# EAGLE design 2 byte input (EAGLE 9.5.0)
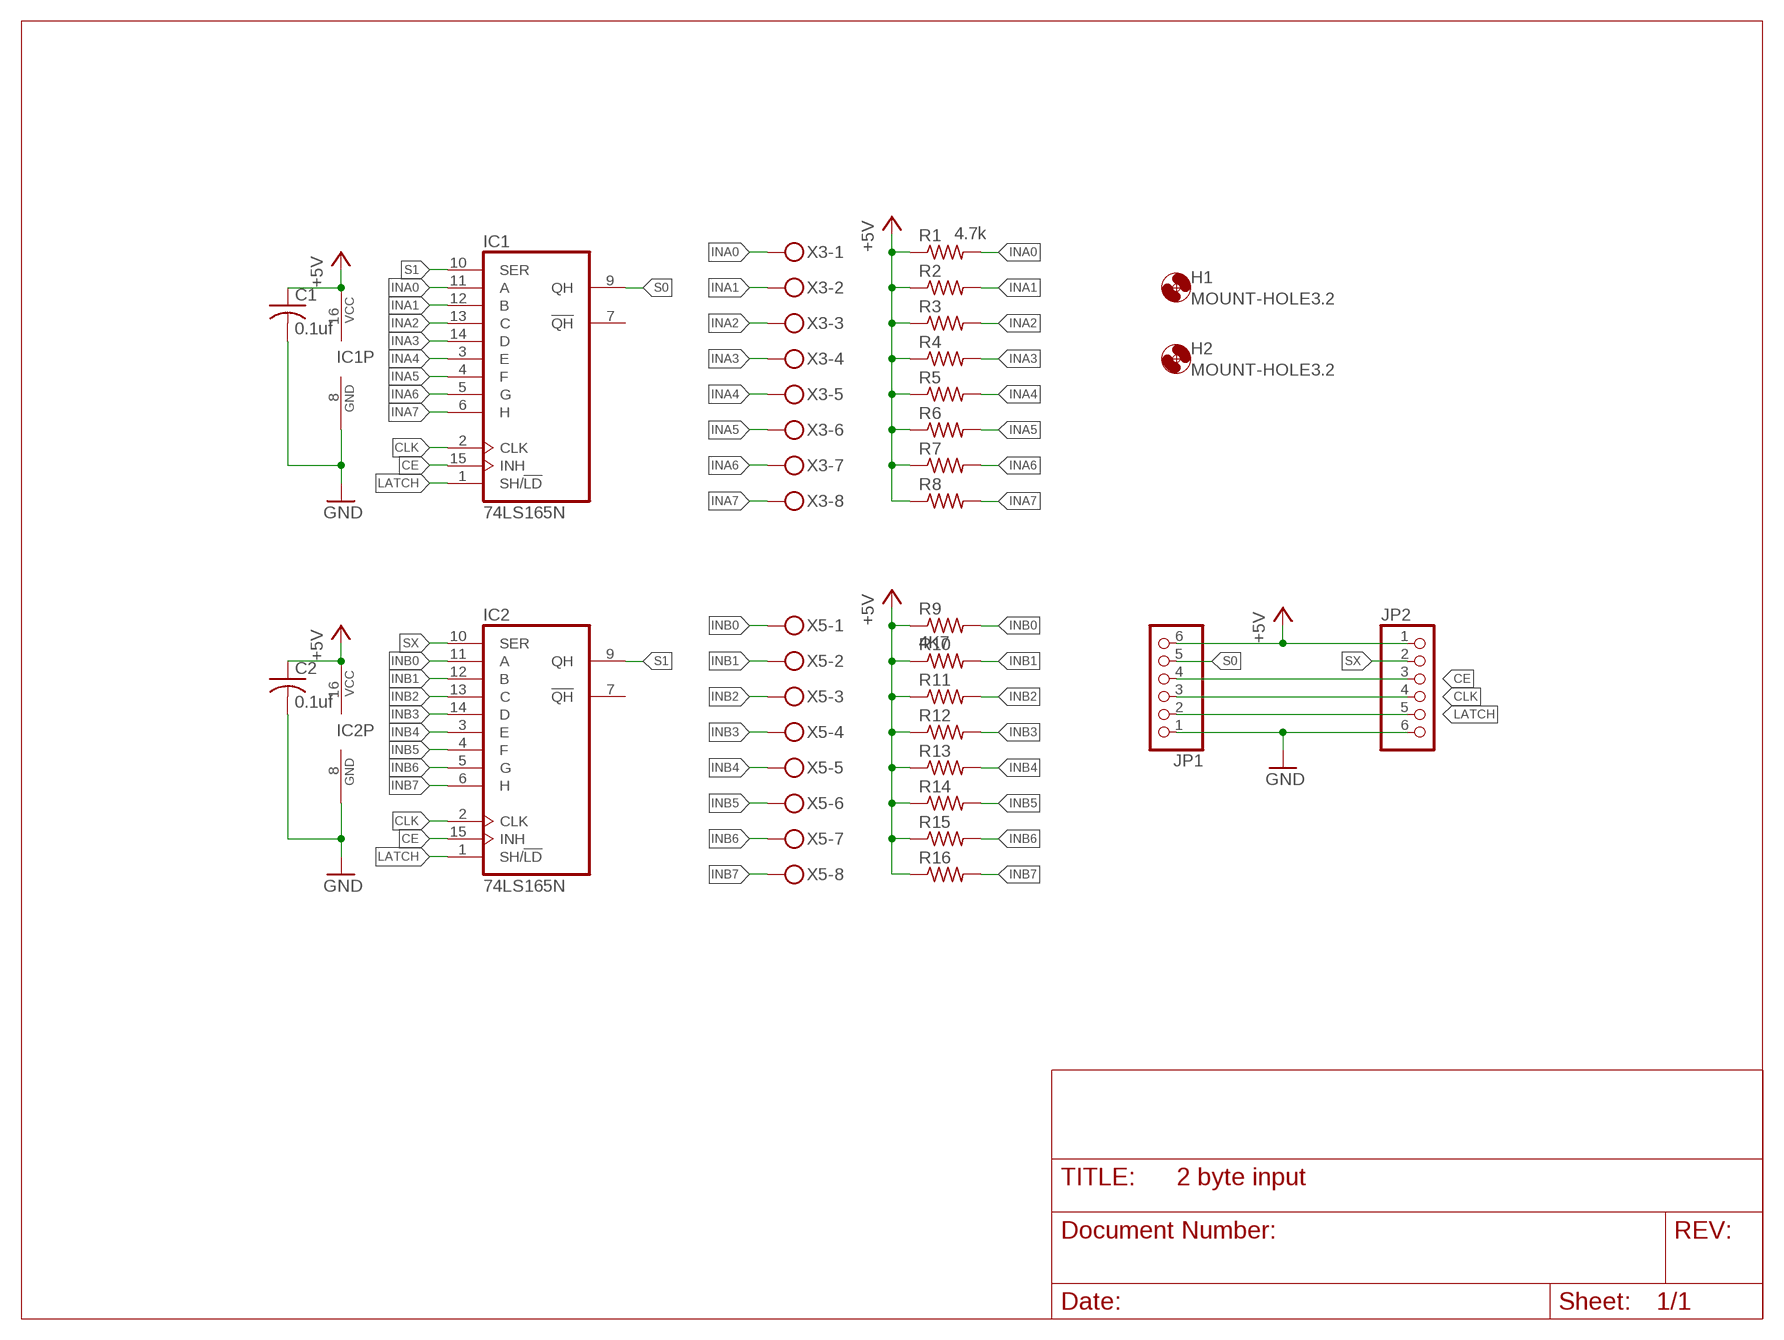
[diagram p0: schematic, sheet 1]

## Parts
C1  0.1uf  C-US025-025X050  [C025-025X050]
C2  0.1uf  C-US025-025X050  [C025-025X050]
H1  MOUNT-HOLE3.2  [3,2]
H2  MOUNT-HOLE3.2  [3,2]
IC1  74LS165N  [DIL16]
IC2  74LS165N  [DIL16]
JP1  PINHD-1X6/90  [1X06/90]
JP2  PINHD-1X6/90  [1X06/90]
R1  4.7k  R-US_0207/2V  [0207/2V]
R2  R-US_0207/2V  [0207/2V]
R3  R-US_0207/2V  [0207/2V]
R4  R-US_0207/2V  [0207/2V]
R5  R-US_0207/2V  [0207/2V]
R6  R-US_0207/2V  [0207/2V]
R7  R-US_0207/2V  [0207/2V]
R8  R-US_0207/2V  [0207/2V]
R9  4K7  R-US_0207/2V  [0207/2V]
R10  R-US_0207/2V  [0207/2V]
R11  R-US_0207/2V  [0207/2V]
R12  R-US_0207/2V  [0207/2V]
R13  R-US_0207/2V  [0207/2V]
R14  R-US_0207/2V  [0207/2V]
R15  R-US_0207/2V  [0207/2V]
R16  R-US_0207/2V  [0207/2V]
X3  MKDSN1,5/8-5,08  [MKDSN1,5/8-5,08]
X5  MKDSN1,5/8-5,08  [MKDSN1,5/8-5,08]

## Nets
+5V: C1.1 C2.1 IC1.16(VCC) IC2.16(VCC) JP1.6 JP2.1 R1.1 R2.1 R3.1 R4.1 R5.1 R6.1 R7.1 R8.1 R9.1 R10.1 R11.1 R12.1 R13.1 R14.1 R15.1 R16.1
CE: IC1.15(INH) IC2.15(INH) JP1.4 JP2.3
CLK: IC1.2(CLK) IC2.2(CLK) JP1.3 JP2.4
GND: C1.2 C2.2 IC1.8(GND) IC2.8(GND) JP1.1 JP2.6
INA0: IC1.11(A) R1.2 X3.1
INA1: IC1.12(B) R2.2 X3.2
INA2: IC1.13(C) R3.2 X3.3
INA3: IC1.14(D) R4.2 X3.4
INA4: IC1.3(E) R5.2 X3.5
INA5: IC1.4(F) R6.2 X3.6
INA6: IC1.5(G) R7.2 X3.7
INA7: IC1.6(H) R8.2 X3.8
INB0: IC2.11(A) R9.2 X5.1
INB1: IC2.12(B) R10.2 X5.2
INB2: IC2.13(C) R11.2 X5.3
INB3: IC2.14(D) R12.2 X5.4
INB4: IC2.3(E) R13.2 X5.5
INB5: IC2.4(F) R14.2 X5.6
INB6: IC2.5(G) R15.2 X5.7
INB7: IC2.6(H) R16.2 X5.8
LATCH: IC1.1(SH/!LD) IC2.1(SH/!LD) JP1.2 JP2.5
S0: IC1.9(QH) JP1.5
S1: IC1.10(SER) IC2.9(QH)
SX: IC2.10(SER) JP2.2
Unconnected: IC1.7(!QH) IC2.7(!QH)

## Library data of the parts
C1 C2 = resistor:C-US: CAPACITOR, American symbol
H1 H2 = holes:MOUNT-HOLE: MOUNTING HOLE with drill center marker
IC1 IC2 = 74xx-us:74*165: 8-bit parallel load SHIFT REGISTER
JP1 JP2 = pinhead:PINHD-1X6: PIN HEADER
R1-R16 = resistor:R-US_: RESISTOR, American symbol
X3 X5 = con-phoenix-508:MKDSN1,5/8-5,08: MKDSN 1,5/ 8-5,08 Printklemme Nennstrom: 13,5 A Nennspannung: 250 V Rastermaß: 5,08 mm Polzahl: 8 Anschlussart: Schraubanschluss Montage: Löten Anschlussrichtung Leiter/Platine: 0 ° Artikelnummer: 1729186 Source: http://eshop.phoenixcontact.com .. 1729186.pdf

## Board
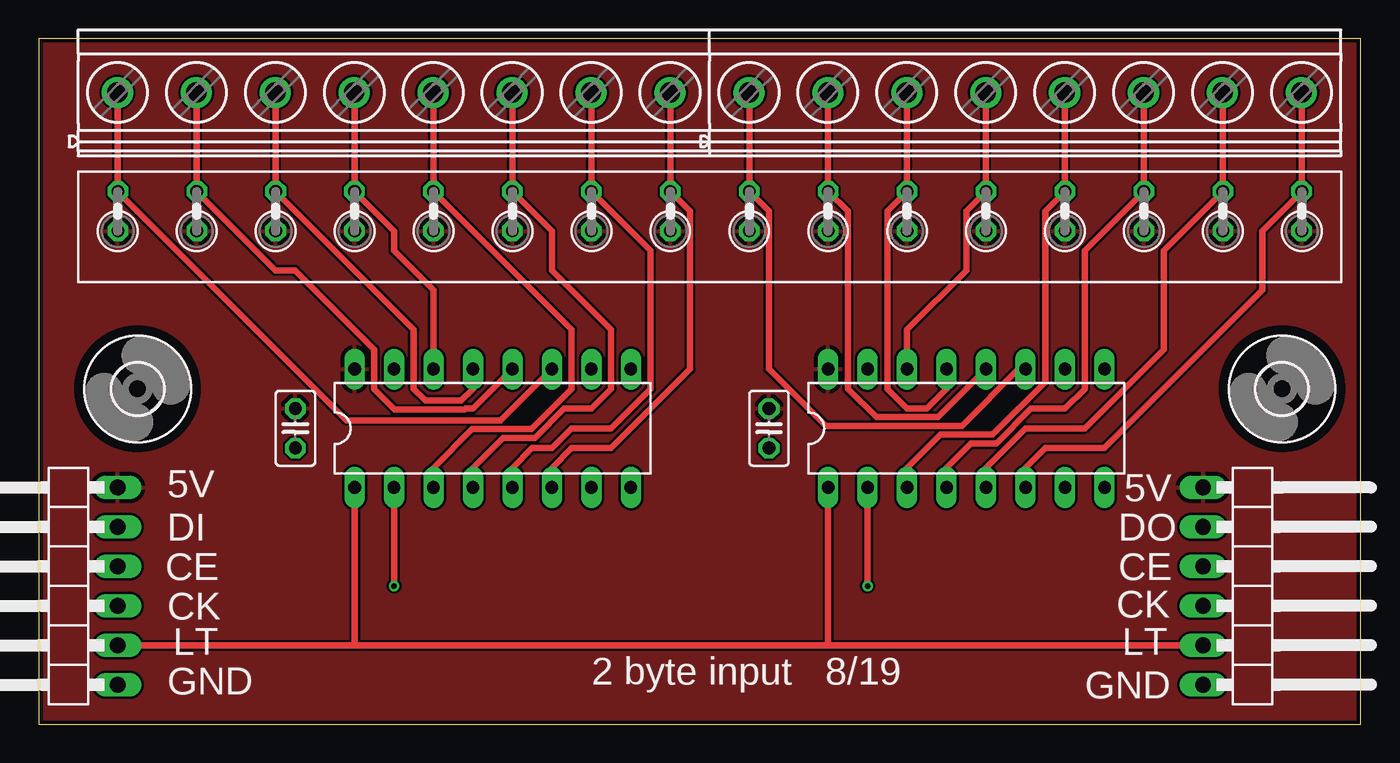
[diagram p1: board, top side]
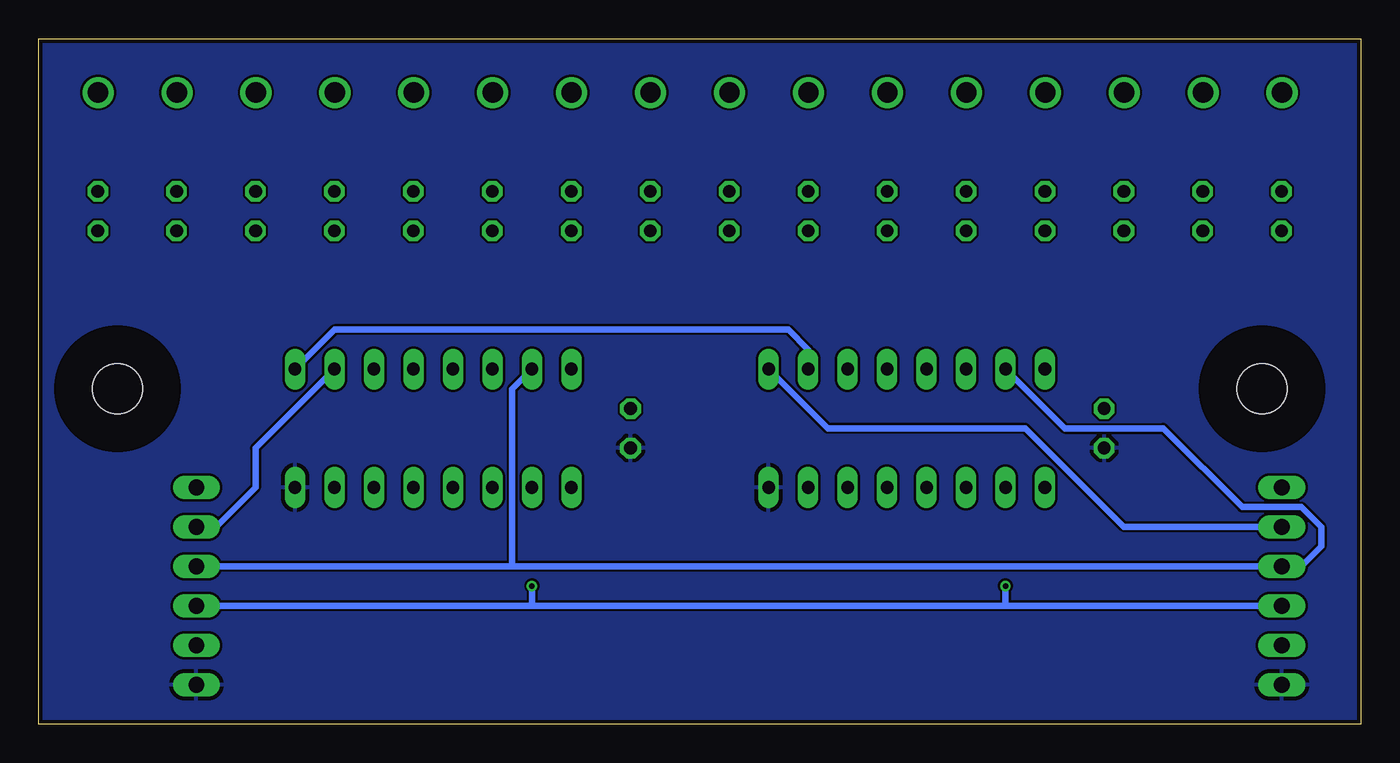
[diagram p2: board, bottom side, seen from below]

Size 85.07 x 44.12 mm. Coordinates in mm from the lower left corner, seen from the top.
Outline: 0,0 85.07,0 85.07,44.12 0,44.12 0,0
Copper layers (1*16): Top 0.035mm / dielectric 1.5mm / Bottom 0.035mm
Design rules "SeeedStudio_2layer": minimum track width 6mil, minimum drill 12mil, track to track 6mil, track to pad 6mil, pad to pad 6mil, via to via 6mil, smd to smd 0mil, copper to edge 10mil, drill to drill 10mil, minimum pad ring 10mil, minimum via ring 6mil, stop-mask expansion 2mil, vias tented up to drill 100mil, thermal gap 10mil

### Footprints (pad centres in the part's own frame; a part is rotated, then mirrored left to right if it is on the bottom)
C025-025X050 = drill 0.813 octagon: 1 -1.27,0; 2 1.27,0
3,2 = hole 3.2: 0,0
DIL16 = drill 0.813 long: 1 -8.89,-3.81; 2 -6.35,-3.81; 3 -3.81,-3.81; 4 -1.27,-3.81; 5 1.27,-3.81; 6 3.81,-3.81; 7 6.35,-3.81; 8 8.89,-3.81; 9 8.89,3.81; 10 6.35,3.81; 11 3.81,3.81; 12 1.27,3.81; 13 -1.27,3.81; 14 -3.81,3.81; 15 -6.35,3.81; 16 -8.89,3.81
1X06/90 = drill 1.016 long: 1 -6.35,-3.81; 2 -3.81,-3.81; 3 -1.27,-3.81; 4 1.27,-3.81; 5 3.81,-3.81; 6 6.35,-3.81
0207/2V = drill 0.813 octagon: 1 -1.27,0; 2 1.27,0
MKDSN1,5/8-5,08 = drill 1.3 pad 2: 1 -17.801,0.025; 2 -12.721,0.025; 3 -7.641,0.025; 4 -2.561,0.025; 5 2.519,0.025; 6 7.599,0.025; 7 12.679,0.025; 8 17.759,0.025

### Placement (x,y rotation side)
C1  16.51,19.05 270 top
C2  46.99,19.05 270 top
H1  6.35,21.59 0 top
H2  80.01,21.59 0 top
IC1  29.21,19.05 0 top
IC2  59.69,19.05 0 top
JP1  1.27,8.89 90 top
JP2  78.74,8.89 270 top
R1  5.08,33.02 90 top
R2  10.16,33.02 90 top
R3  15.24,33.02 90 top
R4  20.32,33.02 90 top
R5  25.4,33.02 90 top
R6  30.48,33.02 90 top
R7  35.56,33.02 90 top
R8  40.64,33.02 90 top
R9  45.72,33.02 90 top
R10  50.8,33.02 90 top
R11  55.88,33.02 90 top
R12  60.96,33.02 90 top
R13  66.04,33.02 90 top
R14  71.12,33.02 90 top
R15  76.2,33.02 90 top
R16  81.28,33.02 90 top
X3  22.86,40.64 0 top
X5  63.5,40.64 0 top

### Tracks (layer width: path | path; a pad name or v marks a point on that pad's centre or on a via)
+5V
  pour Top: -2.54,49.53 87.63,49.53 87.63,-1.27 -1.27,-1.27 -2.54,0
CE
  Bottom 0.406: 54.61,10.16 JP1.4 3.81,10.16 2.54,11.43 2.54,12.7 3.81,13.97 7.62,13.97 12.7,19.05 19.05,19.05 IC1.15 | 54.61,10.16 JP2.3 | IC2.15 54.61,21.59 54.61,10.16
CLK  (via drill 0.35)
  Top 0.406: IC1.2 v22.86,8.89 | IC2.2 v53.34,8.89
  Bottom 0.406: JP1.3 22.86,7.62 | 22.86,7.62 53.34,7.62 | 53.34,7.62 JP2.4 | v22.86,8.89 22.86,7.62 | v53.34,8.89 53.34,7.62
GND
  pour Bottom: -2.54,52.07 87.63,52.07 87.63,-1.27 -2.54,-1.27
INA0
  Top 0.406: X3.1 5.08,40.64 R1.2 19.81,19.56 29.72,19.56 IC1.11
INA1
  Top 0.406: X3.2 10.16,40.64 R2.2 15.24,29.21 16.51,29.21 21.59,24.13 21.59,21.59 22.91,20.27 27.41,20.27 27.46,20.32 27.94,20.32 IC1.12
INA2
  Top 0.406: X3.3 15.24,40.64 R3.2 24.13,25.4 24.13,21.59 24.89,20.83 27.18,20.83 27.94,21.59 IC1.13
INA3
  Top 0.406: X3.4 20.32,40.64 R4.2 22.86,31.75 22.86,30.48 25.4,27.94 IC1.14
INA4
  Top 0.406: X3.5 25.4,40.64 R5.2 34.29,25.4 34.29,21.59 31.7,19 27.89,19 25.4,16.51 IC1.3
INA5
  Top 0.406: X3.6 30.48,40.64 R6.2 33.02,31.75 33.02,29.21 36.83,25.4 36.83,21.59 35.56,20.32 33.81,20.32 31.93,18.44 29.87,18.44 27.94,16.51 IC1.4
INA6
  Top 0.406: X3.7 35.56,40.64 R7.2 39.37,30.48 39.37,21.59 36.83,19.05 34.29,19.05 33.02,17.78 31.75,17.78 30.48,16.51 IC1.5
INA7
  Top 0.406: X3.8 40.64,40.64 R8.2 41.91,33.02 41.91,22.86 36.83,17.78 34.29,17.78 33.02,16.51 IC1.6
INB0
  Top 0.406: X5.1 45.72,40.64 R9.2 46.99,33.02 46.99,22.86 50.65,19.2 59.4,19.2 63.06,22.86 IC2.11
INB1
  Top 0.406: X5.2 50.8,40.64 R10.2 52.07,33.02 52.07,21.59 53.9,19.76 57.86,19.76 IC2.12
INB2
  Top 0.406: X5.3 55.88,40.64 R11.2 54.61,33.02 54.61,21.59 55.88,20.32 57.15,20.32 58.42,21.59 IC2.13
INB3
  Top 0.406: X5.4 60.96,40.64 R12.2 59.69,33.02 59.69,29.21 55.88,25.4 IC2.14
INB4
  Top 0.406: X5.5 66.04,40.64 R13.2 64.77,33.02 64.77,22.03 61.38,18.64 58.01,18.64 55.88,16.51 IC2.3
INB5
  Top 0.406: X5.6 71.12,40.64 R14.2 67.31,30.48 67.31,21.59 66.04,20.32 63.85,20.32 61.61,18.09 59.99,18.09 58.42,16.51 IC2.4
INB6
  Top 0.406: X5.7 76.2,40.64 R15.2 72.39,30.48 72.39,24.13 67.31,19.05 63.5,19.05 60.96,16.51 IC2.5
INB7
  Top 0.406: X5.8 81.28,40.64 R16.2 78.74,31.75 78.74,27.94 68.58,17.78 64.77,17.78 63.5,16.51 IC2.6
LATCH
  Top 0.406: JP1.2 20.32,5.08 | 20.32,5.08 50.8,5.08 | 50.8,5.08 JP2.5 | IC1.1 20.32,5.08 | IC2.1 50.8,5.08
S0
  Bottom 0.406: IC1.9 34.29,19.05 21.59,19.05 15.24,12.7 JP1.5
S1
  Bottom 0.406: IC1.10 35.56,24.13 36.83,25.4 66.04,25.4 IC2.9
SX
  Bottom 0.406: IC2.10 71.12,17.78 71.12,15.24 73.66,12.7 JP2.2

### Text on the board
tNames: 5V | 5V | DI | DO | CE | CE | CK | CK | LT | LT | 2 byte input 8/19 | GND | GND